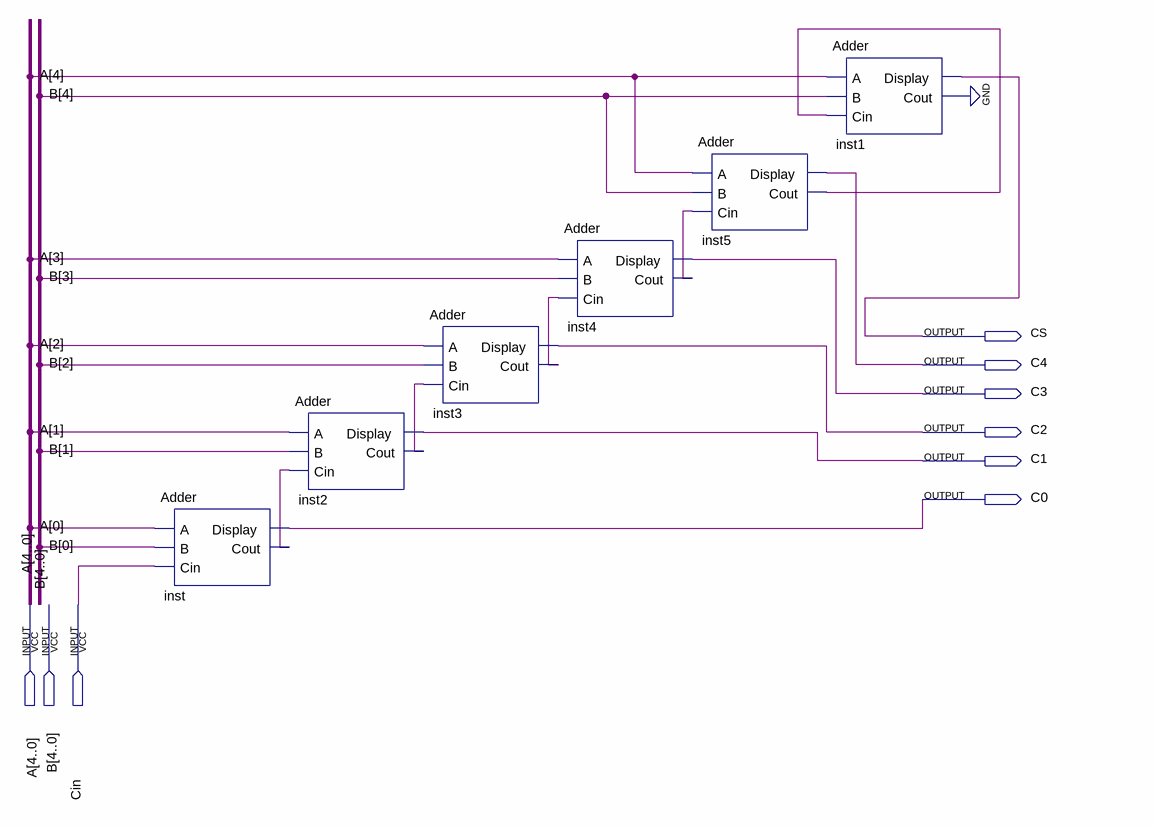
[diagram p0: schematic sheet]
// Quartus schematic adder5bits.bdf as structural Verilog: 6 symbols, 9 pins
module adder5bits (
  input  [4:0] A,
  input  [4:0] B,
  input  Cin,
  output CS,
  output C4,
  output C3,
  output C2,
  output C1,
  output C0
);

  wire inst1_cout, inst2_cout, inst3_cout, inst4_cout, inst5_cout, inst_cout;

  Adder inst (.A(A[0]), .B(B[0]), .Cin(Cin), .Display(C0), .Cout(inst_cout));
  Adder inst2 (.A(A[1]), .B(B[1]), .Cin(inst_cout), .Display(C1), .Cout(inst2_cout));
  Adder inst3 (.A(A[2]), .B(B[2]), .Cin(inst2_cout), .Display(C2), .Cout(inst3_cout));
  Adder inst4 (.A(A[3]), .B(B[3]), .Cin(inst3_cout), .Display(C3), .Cout(inst4_cout));
  Adder inst5 (.A(A[4]), .B(B[4]), .Cin(inst4_cout), .Display(C4), .Cout(inst5_cout));
  Adder inst1 (.A(A[4]), .B(B[4]), .Cin(inst5_cout), .Display(CS), .Cout(inst1_cout));
  // also tied to GND on the sheet: inst1_cout
endmodule
